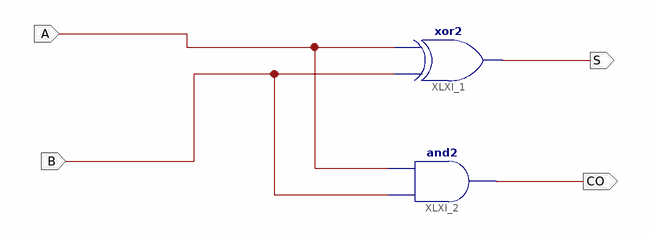
[diagram p0: schematic sheet 1]
// Xilinx ISE schematic HA.sch (spartan6) as structural Verilog: 2 symbols, 4 ports
module HA (
  input  A,
  input  B,
  output S,
  output CO
);

  xor XLXI_1 (S, B, A);
  and XLXI_2 (CO, B, A);
endmodule
